# Altium schematic sheet mixer.SchDoc
size Letter; CompanyName: Signal Laboratories, Inc.; Address1: 3479 Edison Way; Address2: Menlo Park CA 94025; Address3: +1 (877) 778-8435; Address4: siglabs.com; Revision: 1; SheetNumber: 1; SheetTotal: 1
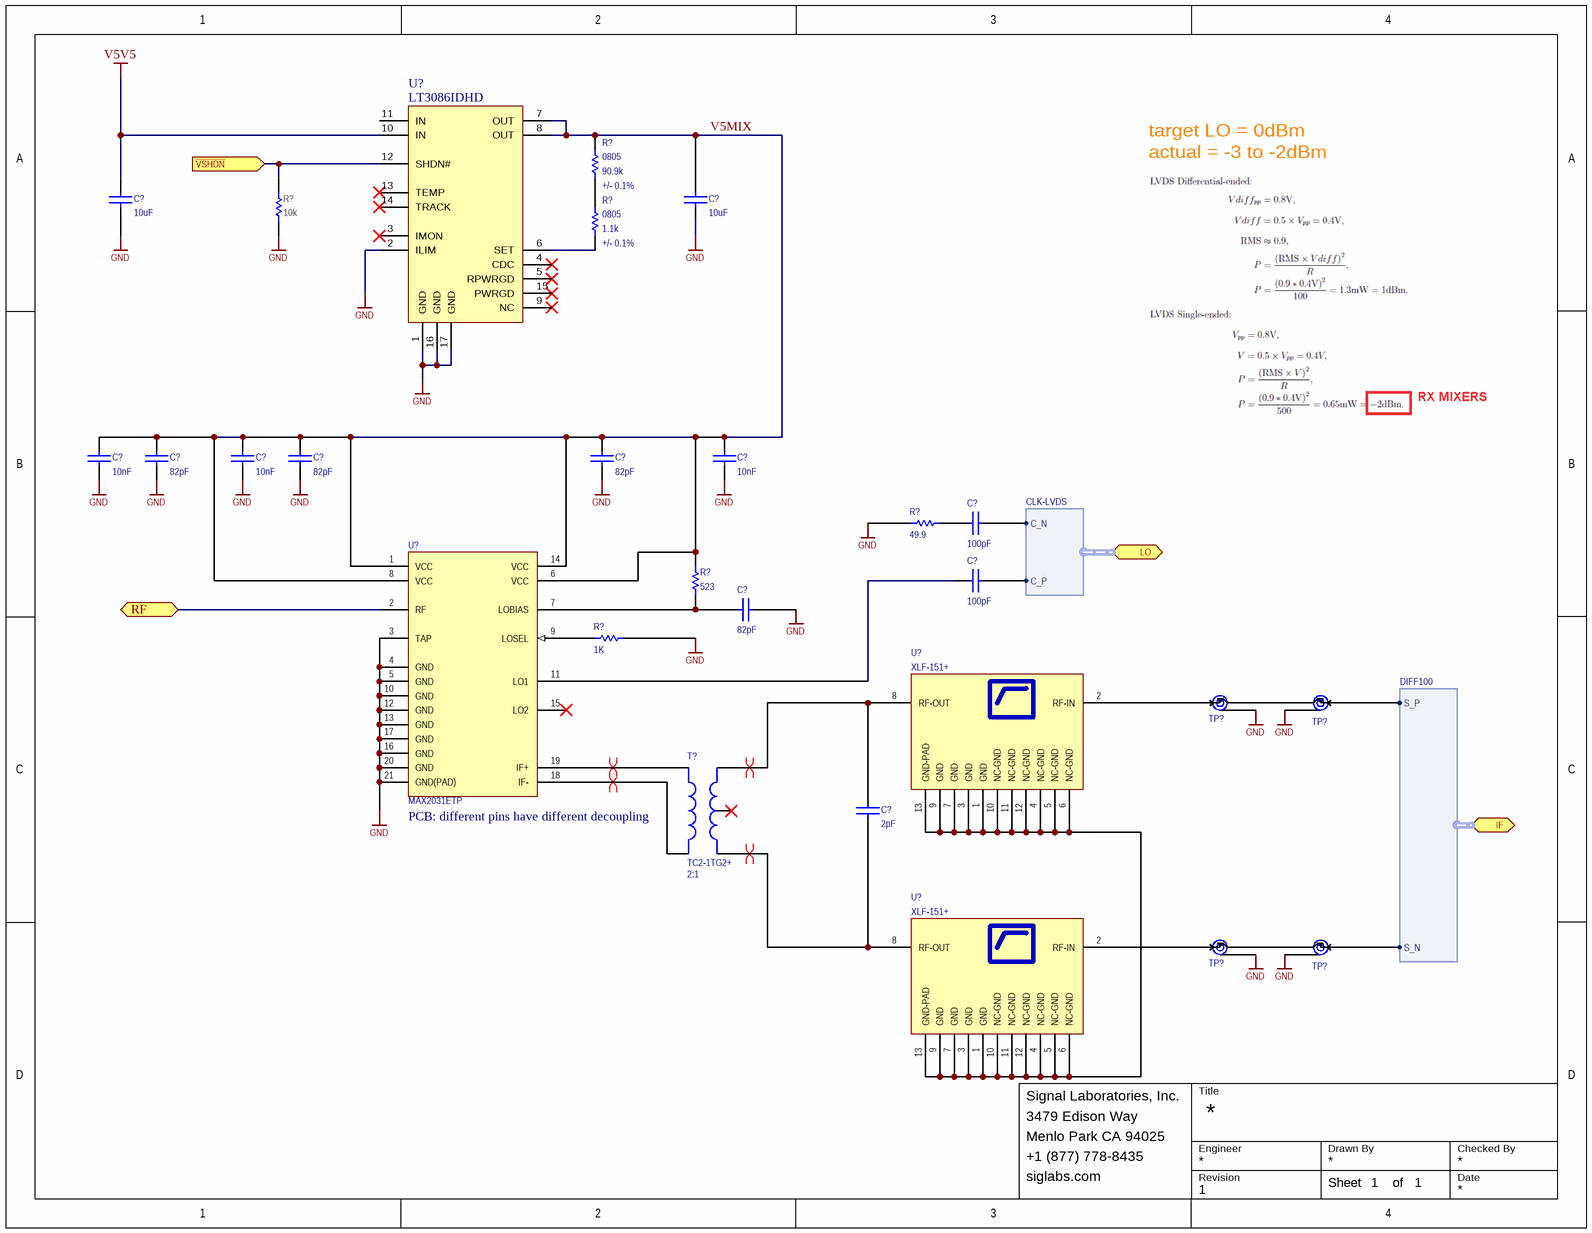
[diagram p0: mixer.SchDoc]

## Parts
(Parts that share a designator on the sheet are numbered #1, #2 ... from top to bottom, then left to right.)
C?#1  value 10uF  [0603]  (hidden comment: CL10A106MA8NRNC)
C?#2  value 10uF  [0603]  (hidden comment: CL10A106MA8NRNC)
C?#3  value 10nF  [CAPC100X50X55L25N]  (hidden comment: GRM155R71H103KA88)
C?#4  value 82pF  [CAPC100X50X55L25N]  (hidden comment: VJ0402D820JXXAJ)
C?#5  value 10nF  [CAPC100X50X55L25N]  (hidden comment: GRM155R71H103KA88)
C?#6  value 82pF  [CAPC100X50X55L25N]  (hidden comment: VJ0402D820JXXAJ)
C?#7  value 82pF  [CAPC100X50X55L25N]  (hidden comment: VJ0402D820JXXAJ)
C?#8  value 10nF  [CAPC100X50X55L25N]  (hidden comment: GRM155R71H103KA88)
C?#9  value 100pF  [CAPC100X50X55L25N]  (hidden comment: CBR04C101F3GAC)
C?#10  value 100pF  [CAPC100X50X55L25N]  (hidden comment: CBR04C101F3GAC)
C?#11  value 82pF  [CAPC100X50X55L25N]  (hidden comment: VJ0402D820JXXAJ)
C?#12  value 2pF  [CAPC100X50X55L25N]  (hidden comment: GJM1555C1H2R0CB01D)
R?#1  value 90.9k  Tolerance: +/- 0.1%  Package: 0805  [RESC2012X70N]  (hidden comment: RG2012P-9092-B-T5)
R?#2  value 10k  [RESC1005X40N]  (hidden comment: ERJ-2RKF1002X)
R?#3  value 1.1k  Tolerance: +/- 0.1%  Package: 0805  [RESC2012X70N]  (hidden comment: RG2012P-112-B-T5)
R?#4  value 49.9  [0603]  (hidden comment: ERJ-3EKF49R9V)
R?#5  value 523  [0603]  (hidden comment: RC0603FR-07523RL)
R?#6  value 1K  [RESC1005X40N]  (hidden comment: RC0402FR-071KL)
T?  value 2:1  [AT224-1A]  (hidden comment: TC2-1TG2+)
TP?#1  MS-180(20)  [MS-180(20)]  (value not drawn)
TP?#2  MS-180(20)  [MS-180(20)]  (value not drawn)
TP?#3  MS-180(20)  [MS-180(20)]  (value not drawn)
TP?#4  MS-180(20)  [MS-180(20)]  (value not drawn)
U?#1  LT3086IDHD  [SON50P500X400X80-17N]
U?#2  XLF-151+  [QFN-XLF-12]
U?#3  MAX2031ETP  [QFN21P65_500X500X80L55X30T320N]
U?#4  XLF-151+  [QFN-XLF-12]

## Ports
IF (harness DIFF100), LO (harness CLK-LVDS), RF, ~{VSHDN} (in)

## Harnesses
CLK-LVDS: C_P, C_N
DIFF100: S_P, S_N

## Nets
GND: C?#1.1 C?#2.1 C?#3.1 C?#4.1 C?#5.1 C?#6.1 C?#7.1 C?#8.1 C?#11.2 R?#2.1 R?#4.1 R?#6.2 TP?#1.G(GND) TP?#2.G(GND) TP?#3.G(GND) TP?#4.G(GND) U?#1.1(GND) U?#1.2(ILIM) U?#1.16(GND) U?#1.17(GND) U?#3.3(TAP) U?#3.4(GND) U?#3.5(GND) U?#3.10(GND) U?#3.12(GND) U?#3.13(GND) U?#3.16(GND) U?#3.17(GND) U?#3.20(GND) U?#3.21(GND(PAD))
V5V5: C?#1.2 U?#1.10(IN)
~{VSHDN}: R?#2.2 U?#1.12(SHDN#) ; port ~{VSHDN}
RF: U?#3.2(RF) ; port RF
V5MIX: C?#2.2 C?#3.2 C?#4.2 C?#5.2 C?#6.2 C?#7.2 C?#8.2 R?#1.2 R?#5.1 U?#1.7(OUT) U?#1.8(OUT) U?#3.1(VCC) U?#3.6(VCC) U?#3.8(VCC) U?#3.14(VCC)
NetC?#9_1: C?#9.1 R?#4.2
NetC?#9_2: C?#9.2 ; port LO.C_N
NetC?#10_1: C?#10.1 U?#3.11(LO1)
NetC?#10_2: C?#10.2 ; port LO.C_P
NetC?#11_1: C?#11.1 R?#5.2 U?#3.7(LOBIAS)
NetC?#12_1: C?#12.1 T?.1(Sec+) U?#4.8(RF-OUT)
NetC?#12_2: C?#12.2 T?.3(Sec-) U?#2.8(RF-OUT)
NetR?#1_1: R?#1.1 R?#3.2
NetR?#3_1: R?#3.1 U?#1.6(SET)
NetR?#6_1: R?#6.1 U?#3.9(LOSEL)
NetT?_4: T?.4(Pri-) U?#3.19(IF+)
NetT?_6: T?.6(Pri+) U?#3.18(IF-)
NetTP?#1_A: TP?#1.A(OUT) TP?#2.A(OUT)
NetTP?#1_C: TP?#1.C(IN) U?#2.2(RF-IN)
NetTP?#2_C: TP?#2.C(IN) ; port IF.S_P
NetTP?#3_A: TP?#3.A(OUT) TP?#4.A(OUT)
NetTP?#3_C: TP?#3.C(IN) U?#4.2(RF-IN)
NetTP?#4_C: TP?#4.C(IN) ; port IF.S_N
NetU?#2_1: U?#2.1(GND) U?#2.3(GND) U?#2.4(NC-GND) U?#2.5(NC-GND) U?#2.6(NC-GND) U?#2.7(GND) U?#2.9(GND) U?#2.10(NC-GND) U?#2.11(NC-GND) U?#2.12(NC-GND) U?#2.13(GND-PAD) U?#4.1(GND) U?#4.3(GND) U?#4.4(NC-GND) U?#4.5(NC-GND) U?#4.6(NC-GND) U?#4.7(GND) U?#4.9(GND) U?#4.10(NC-GND) U?#4.11(NC-GND) U?#4.12(NC-GND) U?#4.13(GND-PAD)

Not connected (* = marked no-connect by the designer): T? 2(SecCT)*; U?#1 3(IMON)* 4(CDC)* 5(RPWRGD)* 9(NC)* 11(IN) 13(TEMP)* 14(TRACK)* 15(PWRGD)*; U?#3 15(LO2)*

## Layout directives
differential pair: NetC?#12_1, NetC?#12_2, NetT?_4, NetT?_6

## Notes on the sheet
- target LO = 0dBm
- actual = -3 to -2dBm
- (near T?) PCB: different pins have different decoupling
- Title
- Engineer
- Revision
- Drawn By
- Checked By
- Date
- Sheet
- of

## Library data of the parts
C?#1 C?#2 = CAP 0603: Ceramic Capacitor 10uF ±20% 25V X5R 0603; Manufacturer: Samsung; Tr: -55:85; Manufacturer P/N: CL10A106MA8NRNC; Voltage: 25V; Package: 0603; Tolerance: ±20%
C?#3 C?#5 C?#8 = CAP 0402: Ceramic Capacitor 10nF ±10% 50V X7R 0402; Manufacturer: Murata; Tr: -55:125; Voltage: 50V; Manufacturer P/N: GRM155R71H103KA88; Package: 0402; Tolerance: ±10%
C?#4 C?#6 C?#7 C?#11 = CAP: Ceramic Capacitor 82pF ±5% 25V NP0 0402; Manufacturer: Vishay Vitramon; Tr: 55:125; Manufacturer P/N: VJ0402D820JXXAJ; Voltage: 25V; Tolerance: ±5%; Footprint: *; Package: 0402
C?#9 C?#10 = CAP 0603: Ceramic Capacitor 100pF ±1% 25V NP0 0402; Manufacturer: Kemet; Tr: -55:125; Manufacturer P/N: CBR04C101F3GAC; Package: CAPC100X50X55L25N; Voltage: 25V; Tolerance: ±1%
C?#12 = CAP 0402: Ceramic Capacitor 2pF ±0.25pF 50V NP0 0402; Manufacturer: Murata; Tr: -55:125; Voltage: 50V; Manufacturer P/N: GJM1555C1H2R0CB01D; Package: 0402; Tolerance: ±0.25pF
R?#1 = RES: Thin Film Resistor 90.9k +/-0.1% SMD 0805; Manufacturer: Susumu; Tr: -55:155; Tcr: *; Manufacturer P/N: RG2012P-9092-B-T5; Alternatives: *; Voltage: *; Power: *
R?#2 = RES: Thick Film Resistor 10k ±1% 0.1W 50V 0402; Manufacturer: Panasonic; Tcr: ±100; Tr: -55:155; Voltage: 50; Power: 0.1; Manufacturer P/N: ERJ-2RKF1002X; Tolerance: ±1%; Alternatives: *; Footprint: *; Package: 0402
R?#3 = RES: Thin Film Resistor 1.1k +/-0.1% SMD 0805; Manufacturer: Susumu; Tr: -55:155; Tcr: *; Manufacturer P/N: RG2012P-112-B-T5; Alternatives: *; Voltage: *; Power: *
R?#4 = RES 0603: Thick Film Resistor 49.9 ±1% 0603; Manufacturer: Panasonic; Tr: -55:155; Package: 0603; Manufacturer P/N: ERJ-3EKF49R9V; Tolerance: ±1%
R?#5 = RES 0603: Thick Film Resistor 523 ±1% 0603; Manufacturer: Yageo; Tr: -55:155; Package: 0603; Manufacturer P/N: RC0603FR-07523RL; Tolerance: ±1%
R?#6 = RES 0402: Thick Film Resistor 1k ±1% 0402; Manufacturer: Yageo; Tr: -55:155; Package: 0402; Manufacturer P/N: RC0402FR-071KL; Do Not Place: *; Tolerance: ±1%
T? = TC1-1TG2+: RF Transformer 0.4 to 500MHz SMD; Manufacturer: Mini-Circuits; Manufacturer P/N: TC2-1TG2+
TP?#1-TP?#4 = MS-180(20): Coaxial Connector Switch; Manufacturer: Hirose; Manufacturer P/N: MS-180(20)
U?#1 = LT3086IDHD: LDO Voltage Regulator; Manufacturer: Linear Technologies; Manufacturer P/N: LT3086IDHD
U?#2 U?#4 = XLF-151+: Reflectionless Low-Pass Filter, DC-150Mhz; Manufacturer: Mini-Circuits; Manufacturer P/N: XLF-151+
U?#3 = MAX2031ETP: Upconversion/Downconversion Mixer; Manufacturer: Maxim; Manufacturer P/N: MAX2031ETP